# EAGLE schematic Central_Circuit (EAGLE 8.0.1)
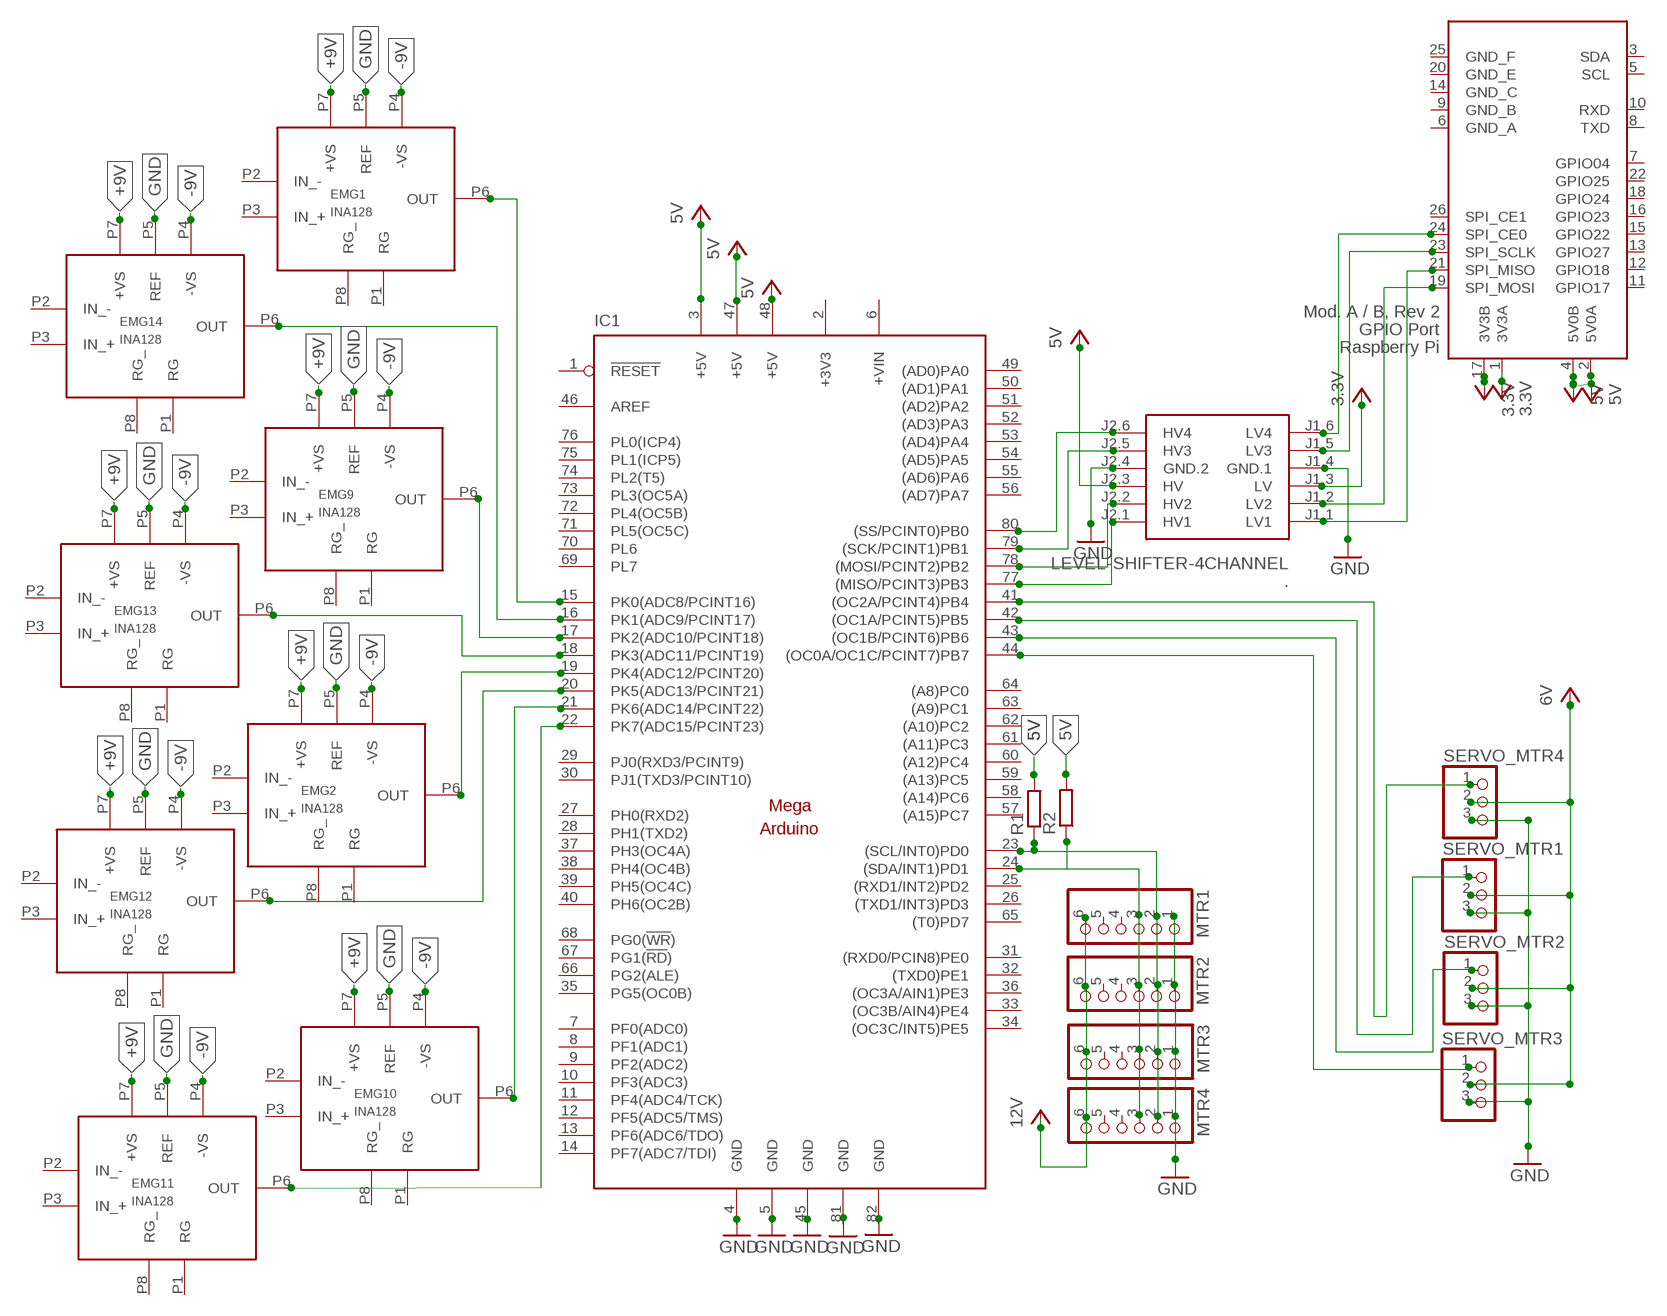
[diagram p0: schematic, sheet 1]

## Parts
.  LEVEL-SHIFTER-4CHANNEL  LEVEL-SHIFTER-4CH  [LEVEL-SHIFTER-4CH]
EMG1  INA128  AD620  [DIL8]
EMG2  INA128  AD620  [DIL8]
EMG9  INA128  AD620  [DIL8]
EMG10  INA128  AD620  [DIL8]
EMG11  INA128  AD620  [DIL8]
EMG12  INA128  AD620  [DIL8]
EMG13  INA128  AD620  [DIL8]
EMG14  INA128  AD620  [DIL8]
IC1  MEGAARDUINO_1  [MEGA_ARDUINO]
MTR1  PINHD-1X6  [1X06]
MTR2  PINHD-1X6  [1X06]
MTR3  PINHD-1X6  [1X06]
MTR4  PINHD-1X6  [1X06]
R1  R-EU_0204/5  [0204/5]
R2  R-EU_0204/5  [0204/5]
SERVO_MTR1  PINHD-1X3  [1X03]
SERVO_MTR2  PINHD-1X3  [1X03]
SERVO_MTR3  PINHD-1X3  [1X03]
SERVO_MTR4  PINHD-1X3  [1X03]
X1  RASPI_BOARD_B-#_FP  [RASPI_BOARD_B-_FULL_PAD]

## Nets
+9V: EMG1.P7(+VS) EMG2.P7(+VS) EMG9.P7(+VS) EMG10.P7(+VS) EMG11.P7(+VS) EMG12.P7(+VS) EMG13.P7(+VS) EMG14.P7(+VS)
-9V: EMG1.P4(-VS) EMG2.P4(-VS) EMG9.P4(-VS) EMG10.P4(-VS) EMG11.P4(-VS) EMG12.P4(-VS) EMG13.P4(-VS) EMG14.P4(-VS)
GND: EMG1.P5(REF) EMG2.P5(REF) EMG9.P5(REF) EMG10.P5(REF) EMG11.P5(REF) EMG12.P5(REF) EMG13.P5(REF) EMG14.P5(REF)
N$20: X1.24(SPI_CE0)
N$21: EMG1.P6(OUT) IC1.15(PK0(ADC8/PCINT16))
N$24: EMG14.P6(OUT) IC1.16(PK1(ADC9/PCINT17))
N$25: EMG9.P6(OUT) IC1.17(PK2(ADC10/PCINT18))
N$26: EMG13.P6(OUT) IC1.18(PK3(ADC11/PCINT19))
N$27: EMG2.P6(OUT) IC1.19(PK4(ADC12/PCINT20))
N$28: EMG12.P6(OUT) IC1.20(PK5(ADC13/PCINT21))
N$34: X1.4(5V0B) ; supply symbol labelled 5V
N$37: EMG10.P6(OUT) IC1.21(PK6(ADC14/PCINT22))
N$39: EMG11.P6(OUT) IC1.22(PK7(ADC15/PCINT23))
VCC: X1.17(3V3B) ; supply symbol labelled 12V, 3.3V
Unconnected: ..J1.1(LV1) ..J1.2(LV2) ..J1.5(LV3) ..J1.6(LV4) ..J2.1(HV1) ..J2.2(HV2) ..J2.5(HV3) ..J2.6(HV4) EMG1.P1(RG) EMG1.P2(IN_-) EMG1.P3(IN_+) EMG1.P8(RG_) EMG2.P1(RG) EMG2.P2(IN_-) EMG2.P3(IN_+) EMG2.P8(RG_) EMG9.P1(RG) EMG9.P2(IN_-) EMG9.P3(IN_+) EMG9.P8(RG_) EMG10.P1(RG) EMG10.P2(IN_-) EMG10.P3(IN_+) EMG10.P8(RG_) EMG11.P1(RG) EMG11.P2(IN_-) EMG11.P3(IN_+) EMG11.P8(RG_) EMG12.P1(RG) EMG12.P2(IN_-) EMG12.P3(IN_+) EMG12.P8(RG_) EMG13.P1(RG) EMG13.P2(IN_-) EMG13.P3(IN_+) EMG13.P8(RG_) EMG14.P1(RG) EMG14.P2(IN_-) EMG14.P3(IN_+) EMG14.P8(RG_) IC1.1(!RESET) IC1.7(PF0(ADC0)) IC1.8(PF1(ADC1)) IC1.9(PF2(ADC2)) IC1.10(PF3(ADC3)) IC1.11(PF4(ADC4/TCK)) IC1.12(PF5(ADC5/TMS)) IC1.13(PF6(ADC6/TDO)) IC1.14(PF7(ADC7/TDI)) IC1.23((SCL/INT0)PD0) IC1.24((SDA/INT1)PD1) IC1.25((RXD1/INT2)PD2) IC1.26((TXD1/INT3)PD3) IC1.27(PH0(RXD2)) IC1.28(PH1(TXD2)) IC1.29(PJ0(RXD3/PCINT9)) IC1.30(PJ1(TXD3/PCINT10)) IC1.31((RXD0/PCIN8)PE0) IC1.32((TXD0)PE1) IC1.33((OC3B/AIN4)PE4) IC1.34((OC3C/INT5)PE5) IC1.35(PG5(OC0B)) IC1.36((OC3A/AIN1)PE3) IC1.37(PH3(OC4A)) IC1.38(PH4(OC4B)) IC1.39(PH5(OC4C)) IC1.40(PH6(OC2B)) IC1.41((OC2A/PCINT4)PB4) IC1.42((OC1A/PCINT5)PB5) IC1.43((OC1B/PCINT6)PB6) IC1.44((OC0A/OC1C/PCINT7)PB7) IC1.46(AREF) IC1.49((AD0)PA0) IC1.50((AD1)PA1) IC1.51((AD2)PA2) IC1.52((AD3)PA3) IC1.53((AD4)PA4) IC1.54((AD5)PA5) IC1.55((AD6)PA6) IC1.56((AD7)PA7) IC1.57((A15)PC7) IC1.58((A14)PC6) IC1.59((A13)PC5) IC1.60((A12)PC4) IC1.61((A11)PC3) IC1.62((A10)PC2) IC1.63((A9)PC1) IC1.64((A8)PC0) IC1.65((T0)PD7) IC1.66(PG2(ALE)) IC1.67(PG1(!RD!)) IC1.68(PG0(!WR!)) IC1.69(PL7) IC1.70(PL6) IC1.71(PL5(OC5C)) IC1.72(PL4(OC5B)) IC1.73(PL3(OC5A)) IC1.74(PL2(T5)) IC1.75(PL1(ICP5)) IC1.76(PL0(ICP4)) IC1.77((MISO/PCINT3)PB3) IC1.78((MOSI/PCINT2)PB2) IC1.79((SCK/PCINT1)PB1) IC1.80((SS/PCINT0)PB0) MTR1.1 MTR1.2 MTR1.3 MTR1.4 MTR1.5 MTR1.6 MTR2.1 MTR2.2 MTR2.3 MTR2.4 MTR2.5 MTR2.6 MTR3.1 MTR3.2 MTR3.3 MTR3.4 MTR3.5 MTR3.6 MTR4.1 MTR4.2 MTR4.3 MTR4.4 MTR4.5 MTR4.6 R1.1 R1.2 R2.1 R2.2 SERVO_MTR1.1 SERVO_MTR1.2 SERVO_MTR1.3 SERVO_MTR2.1 SERVO_MTR2.2 SERVO_MTR2.3 SERVO_MTR3.1 SERVO_MTR3.2 SERVO_MTR3.3 SERVO_MTR4.1 SERVO_MTR4.2 SERVO_MTR4.3 X1.3(SDA) X1.5(SCL) X1.7(GPIO04) X1.8(TXD) X1.10(RXD) X1.11(GPIO17) X1.12(GPIO18) X1.13(GPIO27) X1.15(GPIO22) X1.16(GPIO23) X1.18(GPIO24) X1.19(SPI_MOSI) X1.21(SPI_MISO) X1.22(GPIO25) X1.23(SPI_SCLK) X1.26(SPI_CE1)

## Power pins joined to a net without a drawn wire
3V3A: X1.1(3V3A)
5V0A: X1.2(5V0A)
+3V3: IC1.2(+3V3)
+5V: IC1.3(+5V) IC1.47(+5V) IC1.48(+5V)
+VIN: IC1.6(+VIN)
GND: IC1.4(GND) IC1.5(GND) IC1.45(GND) IC1.81(GND) IC1.82(GND)
GND.1: ..J1.4(GND.1)
GND.2: ..J2.4(GND.2)
GND_A: X1.6(GND_A)
GND_B: X1.9(GND_B)
GND_C: X1.14(GND_C)
GND_E: X1.20(GND_E)
GND_F: X1.25(GND_F)
HV: ..J2.3(HV)
LV: ..J1.3(LV)

## Library data of the parts
. = diy-modules:LEVEL-SHIFTER-4CH: 4-Channel Bi-Directional Logic Level Converter based on BSS128 transistors Click here to find device on ebay.com <http://www.ebay.com/sch/i2c+logic+converter+module>
EMG1 EMG2 EMG9-EMG14 = ad620:AD620
IC1 = arduino:MEGAARDUINO_1: The Arduino Mega is a microcontroller board based on the ATmega1280. - 54 digital input/output pins (of which 14 can be used as PWM outputs) - 16 analog inputs - 4 UARTs (hardware serial ports) - 16 MHz crystal oscillator - USB connection - power jack - ICSP header - reset button It contains everything needed to support the microcontroller; simply connect it to a computer with a USB cable or power it with a AC-to-DC adapter or battery to get started. The Mega is compatible with most shields designed for the Arduino Duemilanove or Diecimila. http://arduino.cc/en/Main/ArduinoBoardMega
MTR1-MTR4 = pinhead:PINHD-1X6: PIN HEADER
R1 R2 = rcl:R-EU_: RESISTOR, European symbol
SERVO_MTR1-SERVO_MTR4 = pinhead:PINHD-1X3: PIN HEADER
X1 = raspberrypi_bastelstube_v13:RASPI_BOARD_B-#: Raspberry Pi GPIO connector with markings for the outer dimensions of the Raspberry Pi board model B+ GPIO connector reduced to 26 pins to match models A and B with different sets of drill holes or mounting pads All pins connected